# Altium schematic sheet FPGA.SchDoc
size B
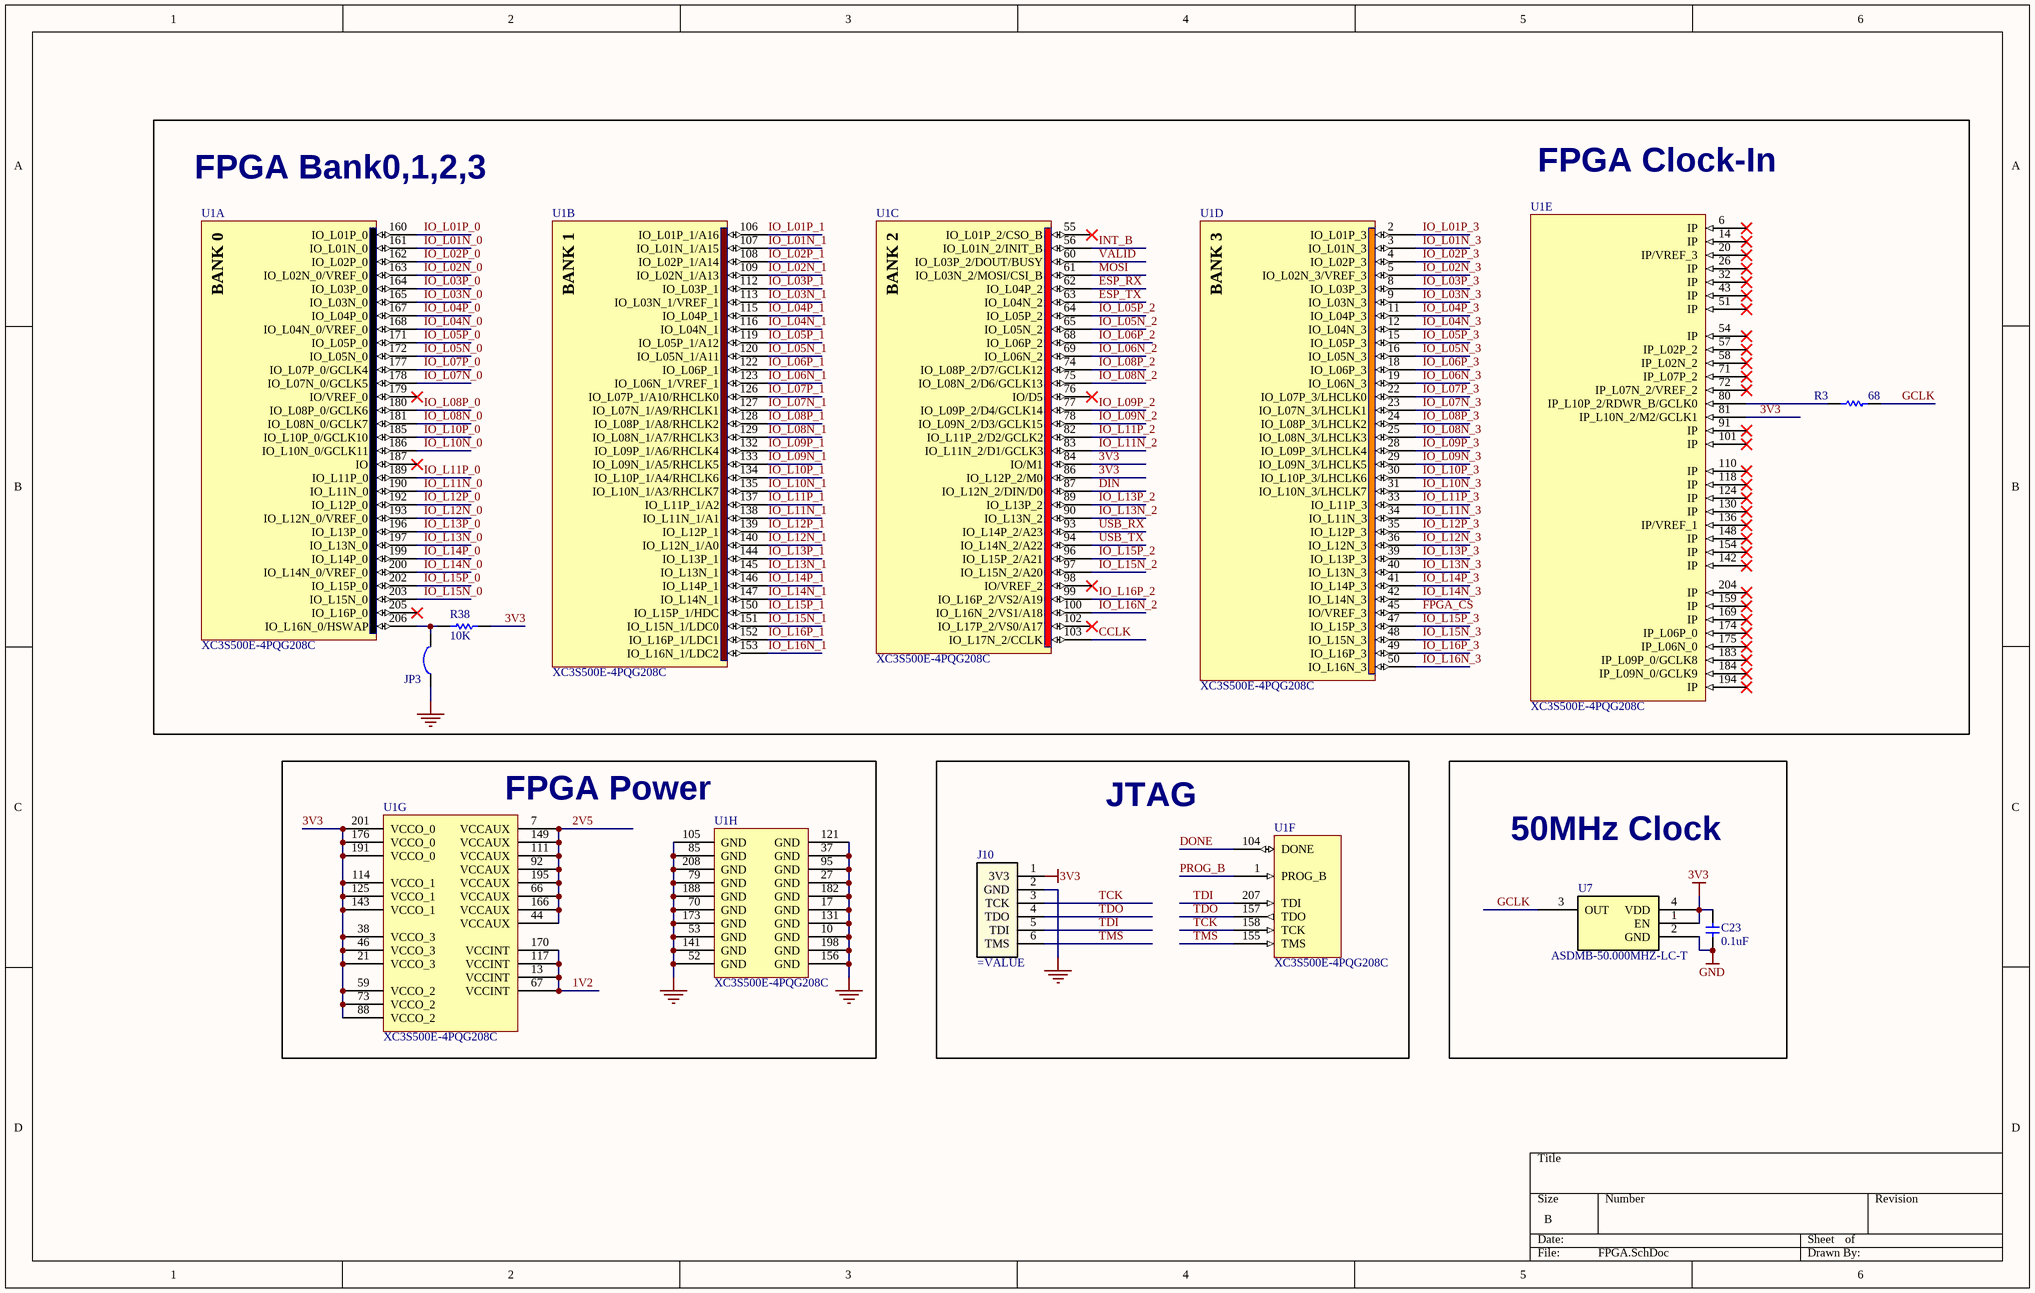
[diagram p0: FPGA.SchDoc]

## Parts
C23  0.1uF  [C0603]
J10  (no value)  [JTAG - Digilent HS1]
JP3  Solder Jumper  [SOLDER_JUMPER]  (value not drawn)  (no BOM)
R3  68  [R0603]
R38  10K  [R0603]
U1  XC3S500E-4PQG208C  [PQG208_N]  (parts A,B,C,D,E,F,G,H of 8)
U7  ASDMB-50.000MHZ-LC-T  [ASDMB - osc]

## Blocks framed on the sheet
FPGA Power: U1
JTAG: J10 U1
50MHz Clock: C23 U7

## Nets
3V3: C23.2 J10.1(3V3) R38.2 U1.21(VCCO_3) U1.38(VCCO_3) U1.46(VCCO_3) U1.59(VCCO_2) U1.73(VCCO_2) U1.81(IP_L10N_2/M2/GCLK1) U1.84(IO/M1) U1.86(IO_L12P_2/M0) U1.88(VCCO_2) U1.114(VCCO_1) U1.125(VCCO_1) U1.143(VCCO_1) U1.176(VCCO_0) U1.191(VCCO_0) U1.201(VCCO_0) U7.1(EN) U7.4(VDD)
GND: C23.1 J10.2(GND) JP3.2 U1.10(GND) U1.17(GND) U1.27(GND) U1.37(GND) U1.52(GND) U1.53(GND) U1.70(GND) U1.79(GND) U1.85(GND) U1.95(GND) U1.105(GND) U1.121(GND) U1.131(GND) U1.141(GND) U1.156(GND) U1.173(GND) U1.182(GND) U1.188(GND) U1.198(GND) U1.208(GND) U7.2(GND)
1V2: U1.13(VCCINT) U1.67(VCCINT) U1.117(VCCINT) U1.170(VCCINT)
2V5: U1.7(VCCAUX) U1.44(VCCAUX) U1.66(VCCAUX) U1.92(VCCAUX) U1.111(VCCAUX) U1.149(VCCAUX) U1.166(VCCAUX) U1.195(VCCAUX)
CCLK: U1.103(IO_L17N_2/CCLK)
DIN: U1.87(IO_L12N_2/DIN/D0)
DONE: U1.104(DONE)
ESP_RX: U1.62(IO_L04P_2)
ESP_TX: U1.63(IO_L04N_2)
FPGA_CS: U1.45(IO/VREF_3)
GCLK: R3.1 U7.3(OUT)
INT_B: U1.56(IO_L01N_2/INIT_B)
IO_L01N_0: U1.161(IO_L01N_0)
IO_L01N_1: U1.107(IO_L01N_1/A15)
IO_L01N_3: U1.3(IO_L01N_3)
IO_L01P_0: U1.160(IO_L01P_0)
IO_L01P_1: U1.106(IO_L01P_1/A16)
IO_L01P_3: U1.2(IO_L01P_3)
IO_L02N_0: U1.163(IO_L02N_0/VREF_0)
IO_L02N_1: U1.109(IO_L02N_1/A13)
IO_L02N_3: U1.5(IO_L02N_3/VREF_3)
IO_L02P_0: U1.162(IO_L02P_0)
IO_L02P_1: U1.108(IO_L02P_1/A14)
IO_L02P_3: U1.4(IO_L02P_3)
IO_L03N_0: U1.165(IO_L03N_0)
IO_L03N_1: U1.113(IO_L03N_1/VREF_1)
IO_L03N_3: U1.9(IO_L03N_3)
IO_L03P_0: U1.164(IO_L03P_0)
IO_L03P_1: U1.112(IO_L03P_1)
IO_L03P_3: U1.8(IO_L03P_3)
IO_L04N_0: U1.168(IO_L04N_0/VREF_0)
IO_L04N_1: U1.116(IO_L04N_1)
IO_L04N_3: U1.12(IO_L04N_3)
IO_L04P_0: U1.167(IO_L04P_0)
IO_L04P_1: U1.115(IO_L04P_1)
IO_L04P_3: U1.11(IO_L04P_3)
IO_L05N_0: U1.172(IO_L05N_0)
IO_L05N_1: U1.120(IO_L05N_1/A11)
IO_L05N_2: U1.65(IO_L05N_2)
IO_L05N_3: U1.16(IO_L05N_3)
IO_L05P_0: U1.171(IO_L05P_0)
IO_L05P_1: U1.119(IO_L05P_1/A12)
IO_L05P_2: U1.64(IO_L05P_2)
IO_L05P_3: U1.15(IO_L05P_3)
IO_L06N_1: U1.123(IO_L06N_1/VREF_1)
IO_L06N_2: U1.69(IO_L06N_2)
IO_L06N_3: U1.19(IO_L06N_3)
IO_L06P_1: U1.122(IO_L06P_1)
IO_L06P_2: U1.68(IO_L06P_2)
IO_L06P_3: U1.18(IO_L06P_3)
IO_L07N_0: U1.178(IO_L07N_0/GCLK5)
IO_L07N_1: U1.127(IO_L07N_1/A9/RHCLK1)
IO_L07N_3: U1.23(IO_L07N_3/LHCLK1)
IO_L07P_0: U1.177(IO_L07P_0/GCLK4)
IO_L07P_1: U1.126(IO_L07P_1/A10/RHCLK0)
IO_L07P_3: U1.22(IO_L07P_3/LHCLK0)
IO_L08N_0: U1.181(IO_L08N_0/GCLK7)
IO_L08N_1: U1.129(IO_L08N_1/A7/RHCLK3)
IO_L08N_2: U1.75(IO_L08N_2/D6/GCLK13)
IO_L08N_3: U1.25(IO_L08N_3/LHCLK3)
IO_L08P_0: U1.180(IO_L08P_0/GCLK6)
IO_L08P_1: U1.128(IO_L08P_1/A8/RHCLK2)
IO_L08P_2: U1.74(IO_L08P_2/D7/GCLK12)
IO_L08P_3: U1.24(IO_L08P_3/LHCLK2)
IO_L09N_1: U1.133(IO_L09N_1/A5/RHCLK5)
IO_L09N_2: U1.78(IO_L09N_2/D3/GCLK15)
IO_L09N_3: U1.29(IO_L09N_3/LHCLK5)
IO_L09P_1: U1.132(IO_L09P_1/A6/RHCLK4)
IO_L09P_2: U1.77(IO_L09P_2/D4/GCLK14)
IO_L09P_3: U1.28(IO_L09P_3/LHCLK4)
IO_L10N_0: U1.186(IO_L10N_0/GCLK11)
IO_L10N_1: U1.135(IO_L10N_1/A3/RHCLK7)
IO_L10N_3: U1.31(IO_L10N_3/LHCLK7)
IO_L10P_0: U1.185(IO_L10P_0/GCLK10)
IO_L10P_1: U1.134(IO_L10P_1/A4/RHCLK6)
IO_L10P_3: U1.30(IO_L10P_3/LHCLK6)
IO_L11N_0: U1.190(IO_L11N_0)
IO_L11N_1: U1.138(IO_L11N_1/A1)
IO_L11N_2: U1.83(IO_L11N_2/D1/GCLK3)
IO_L11N_3: U1.34(IO_L11N_3)
IO_L11P_0: U1.189(IO_L11P_0)
IO_L11P_1: U1.137(IO_L11P_1/A2)
IO_L11P_2: U1.82(IO_L11P_2/D2/GCLK2)
IO_L11P_3: U1.33(IO_L11P_3)
IO_L12N_0: U1.193(IO_L12N_0/VREF_0)
IO_L12N_1: U1.140(IO_L12N_1/A0)
IO_L12N_3: U1.36(IO_L12N_3)
IO_L12P_0: U1.192(IO_L12P_0)
IO_L12P_1: U1.139(IO_L12P_1)
IO_L12P_3: U1.35(IO_L12P_3)
IO_L13N_0: U1.197(IO_L13N_0)
IO_L13N_1: U1.145(IO_L13N_1)
IO_L13N_2: U1.90(IO_L13N_2)
IO_L13N_3: U1.40(IO_L13N_3)
IO_L13P_0: U1.196(IO_L13P_0)
IO_L13P_1: U1.144(IO_L13P_1)
IO_L13P_2: U1.89(IO_L13P_2)
IO_L13P_3: U1.39(IO_L13P_3)
IO_L14N_0: U1.200(IO_L14N_0/VREF_0)
IO_L14N_1: U1.147(IO_L14N_1)
IO_L14N_3: U1.42(IO_L14N_3)
IO_L14P_0: U1.199(IO_L14P_0)
IO_L14P_1: U1.146(IO_L14P_1)
IO_L14P_3: U1.41(IO_L14P_3)
IO_L15N_0: U1.203(IO_L15N_0)
IO_L15N_1: U1.151(IO_L15N_1/LDC0)
IO_L15N_2: U1.97(IO_L15N_2/A20)
IO_L15N_3: U1.48(IO_L15N_3)
IO_L15P_0: U1.202(IO_L15P_0)
IO_L15P_1: U1.150(IO_L15P_1/HDC)
IO_L15P_2: U1.96(IO_L15P_2/A21)
IO_L15P_3: U1.47(IO_L15P_3)
IO_L16N_1: U1.153(IO_L16N_1/LDC2)
IO_L16N_2: U1.100(IO_L16N_2/VS1/A18)
IO_L16N_3: U1.50(IO_L16N_3)
IO_L16P_1: U1.152(IO_L16P_1/LDC1)
IO_L16P_2: U1.99(IO_L16P_2/VS2/A19)
IO_L16P_3: U1.49(IO_L16P_3)
MOSI: U1.61(IO_L03N_2/MOSI/CSI_B)
PROG_B: U1.1(PROG_B)
TCK: J10.3(TCK) U1.158(TCK)
TDI: J10.5(TDI) U1.207(TDI)
TDO: J10.4(TDO) U1.157(TDO)
TMS: J10.6(TMS) U1.155(TMS)
USB_RX: U1.93(IO_L14P_2/A23)
USB_TX: U1.94(IO_L14N_2/A22)
VALID: U1.60(IO_L03P_2/DOUT/BUSY)
NetJP3_1: JP3.1 R38.1 U1.206(IO_L16N_0/HSWAP)
NetR3_2: R3.2 U1.80(IP_L10P_2/RDWR_B/GCLK0)

Not connected (* = marked no-connect by the designer): U1 6(IP)* 14(IP)* 20(IP/VREF_3)* 26(IP)* 32(IP)* 43(IP)* 51(IP)* 54(IP)* 55(IO_L01P_2/CSO_B)* 57(IP_L02P_2)* 58(IP_L02N_2)* 71(IP_L07P_2)* 72(IP_L07N_2/VREF_2)* 76(IO/D5)* 91(IP)* 98(IO/VREF_2)* 101(IP)* 102(IO_L17P_2/VS0/A17)* 110(IP)* 118(IP)* 124(IP)* 130(IP)* 136(IP/VREF_1)* 142(IP)* 148(IP)* 154(IP)* 159(IP)* 169(IP)* 174(IP_L06P_0)* 175(IP_L06N_0)* 179(IO/VREF_0)* 183(IP_L09P_0/GCLK8)* 184(IP_L09N_0/GCLK9)* 187(IO)* 194(IP)* 204(IP)* 205(IO_L16P_0)*

## Notes on the sheet
- (near U1) FPGA Bank0,1,2,3
- (near U1) FPGA Clock-In
- (in symbol XC3S500E-4PQG208C, part A) BANK 0
- (in symbol XC3S500E-4PQG208C, part B) BANK 1
- (in symbol XC3S500E-4PQG208C, part C) BANK 2
- (in symbol XC3S500E-4PQG208C, part D) BANK 3

## Library data of the parts
C23 = GRM188R71H104KA93D: CAP CER .1UF 50V 10% X7R 0603; Manufacturer: Murata Electronics North America; Capacitance: 0.1µF; Manufacturer Part Number: GRM188R71H104KA93D; Value: CAP CER .1UF 50V 10% X7R 0603; Supplier 1: Digi-Key; Supplier Part Number 1: 490-1519-1-ND; RoHS: RoHS Compliant; Category: Capacitors; Stock 1: 9370695; Pricing 1: 10=0.037, 100=0.0221, 500=0.01276, 1000=0.00884 (USD); Voltage - Rated: 50V; Tolerance: ±10%; Temperature Coefficient: X7R; Mounting Type: Surface Mount, MLCC; Operating Temperature: -55°C ~ 125°C; Features: -; Applications: General Purpose; Ratings: -; Package / Case: 0603 (1608 Metric); Size / Dimension: 0.063" L x 0.031" W (1.60mm x 0.80mm); Lead Spacing: -; Thickness: 0.80mm; Packaging: Cut Tape (CT); Lead Style: -; ComponentLink1URL: http://search.murata.co.jp/Ceramy/image/img/PDF/ENG/GRM188R71H104KA93.pdf; ComponentLink1Description: http://search.murata.co.jp/Ceramy/image/img/PDF/ENG/GRM188R71H104KA93.pdf
J10 = JTAG - Digilent HS1: DIGILENT - 410-205 - PROGRAMMING CABLE, JTAG HS1, USB2; Manufacturer: Samtec; Manufacturer Part Number: TSW-106-08-G-S-RA; Lead Time: 0 weeks; Peak Solder Temperature: 260 deg C; MSL Level Min: N/R; Connector Type: Header, Unshrouded; Number of Positions: 6; Number of Positions Loaded: All; Pitch: 0.100" (2.54mm); Supplier 1: Arrow; RoHS: CHINA ROHS: Compliant / EU ROHS: Compliant; Stock 1: 0; Pricing 1: 0=0.2649 (USD); ComponentLink1URL: http://components.arrow.com/partservice/dataview/altium/2677508S3639200N1004?apiKey=aa438727d59eed98c4bed826d8d949c84cb5e685b92bf87346a0226bd2658797; ComponentLink1Description: http://components.arrow.com/partservice/dataview/altium/2677508S3639200N1004?apiKey=aa438727d59eed98c4bed826d8d949c84cb5e685b92bf87346a0226bd2658797; Supplier Part Number 1: 2677508S3639200N1004; Package Quantity: 1; Termination Finish: Au/Ni; MSL Level Max: N/R; MSL (Moisture Sensitivity Level): N/R; China ROHS Lead (X -> above / O -> below threshold): O; China ROHS Mercury (X -> above / O -> below threshold): O; China ROHS Cadmium (X -> above / O -> below threshold): O; China ROHS Hex Chromium (X -> above / O -> below threshold): O; China ROHS PBB (X -> above / O -> below threshold): O; China ROHS PBDE (X -> above / O -> below threshold): O; EU_ROHS_PROD_EXEMPTION_BY_SUPP: N/R; Supplier 2: Digi-Key; Category: Connectors, Interconnects; Stock 2: 0; Pricing 2: 1=0.94, 10=0.841, 100=0.6926, 500=0.5475, 1000=0.46999, 5000=0.42877, 10000=0.41228 (USD); Contact Type: Male Pin; Number of Rows: 1; Row Spacing: -; Contact Mating Length: 0.230" (5.84mm); Mounting Type: Through Hole; Termination: Solder; Fastening Type: -; Features: -; Contact Finish: Gold; Contact Finish Thickness: 10µin (0.25µm); Color: Black; Packaging: Bulk; ComponentLink2URL: http://www.samtec.com/documents/webfiles/cpdf/TSW-XXX-XX-XXX-X-XX-XXX-MKT.pdf; ComponentLink2Description: http://www.samtec.com/documents/webfiles/cpdf/TSW-XXX-XX-XXX-X-XX-XXX-MKT.pdf; Supplier Part Number 2: SAM1038-06-ND
JP3 = Solder Jumper: Solder/Configuration Jumper; Manufacturer: n/a; Manufacturer Part Number: n/a; Source: n/a; Source Part Number: n/a; ROHS Certificate: n/a
R3 R38 = Res Semi: Resistor 0603; MFG: ROHM; MFG P/N: MCR03ERTF1202; Supplier1: Digikey; Supplier1 Price: 0.4
U1 = XC3S500E-4PQG208C: Spartan-3E 1.2V FPGA, 158 User I/Os, 208-Pin PQFP, Standard Performance, Commercial Grade, Pb-Free; Published: 6-Jun-2005; LatestRevisionDate: 30-Oct-2009; LatestRevisionNote: Updated to datasheet version 3.8 Aug-2009.; DatasheetVersion: ver3.8, Aug-2009; PackageVersion: ver1.2, Jun-2004; PackageReference: PQG208; Publisher: Altium Limited; PackageDescription: 208-Pin Plastic Quad Flat Pack (PQG208) - Pb-Free; Supplier 1: Digi-Key; Supplier Part Number 1: 122-1520-ND; Code_JEDEC: MS-029-FA-1; ComponentLink1Description: Spartan-3E Datasheet; ComponentLink1URL: http://www.xilinx.com/support/documentation/data_sheets/ds312.pdf; ComponentLink2Description: PQG208 Package Drawing; ComponentLink2URL: http://www.xilinx.com/support/documentation/package_specs/pq208.pdf; ComponentLink3Description: Spartan-3E Documents; ComponentLink3URL: http://www.xilinx.com/support/documentation/spartan-3e.htm; ComponentLink4Description: Xilinx.com Home; ComponentLink4URL: http://www.xilinx.com
U7 = ASDMB-50.000MHZ-LC-T: OSC MEMS 50.000 MHZ SMD; Manufacturer: Abracon Corporation; Frequency: 50MHz; Function: Tri-State (Output Enable); Output: CMOS; Voltage - Supply: 1.8 V ~ 3.3 V; Frequency Stability: ±50ppm; Current - Supply (Max): 16mA; Current - Supply (Disable) (Max): 15µA; Supplier 1: Digi-Key; Manufacturer Part Number: ASDMB-50.000MHZ-LC-T; RoHS: RoHS Compliant; Category: Crystals and Oscillators; Stock 1: 967; Pricing 1: 1=1.69, 10=1.463, 50=1.2826, 100=1.0125, 500=0.855 (USD); Type: MEMS (Silicon); Operating Temperature: -40°C ~ 85°C; Mounting Type: Surface Mount; Size / Dimension: 0.098" L x 0.079" W (2.50mm x 2.00mm); Height: 0.035" (0.90mm); Package / Case: 4-SMD, No Lead (DFN, LCC); Packaging: Cut Tape (CT); ComponentLink1URL: http://www.abracon.com/Oscillators/ASDMB.pdf; ComponentLink1Description: http://www.abracon.com/Oscillators/ASDMB.pdf; Supplier Part Number 1: 535-11738-1-ND; Value: ASDMB-50.000MHZ-LC-T